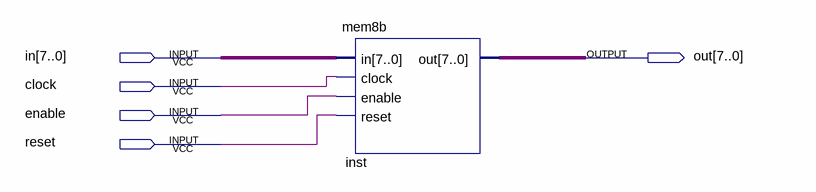
[diagram p0: schematic sheet]
// Quartus schematic rad.bdf as structural Verilog: 1 symbols, 5 pins
module rad (
  input  [7:0] in,
  input  clock,
  input  enable,
  input  reset,
  output [7:0] out
);

  mem8b inst (.in(in), .clock(clock), .enable(enable), .reset(reset), .out(out));
endmodule
